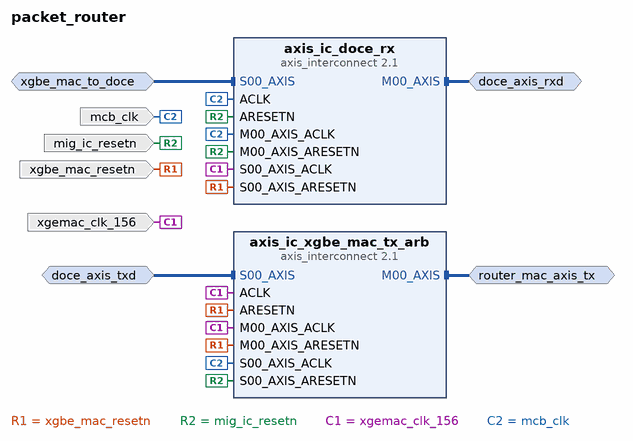
[diagram p0: block diagram of the top level]
# Vivado block design packet_router, xc7z045ffg900-2, Vivado 2017.4
create_bd_design packet_router

create_bd_intf_port -mode Master -vlnv xilinx.com:interface:axis_rtl:1.0 doce_axis_rxd
set_property -dict {CONFIG.FREQ_HZ 200000000 CONFIG.CLK_DOMAIN mcb_clk} [get_bd_intf_ports doce_axis_rxd]
create_bd_intf_port -mode Slave -vlnv xilinx.com:interface:axis_rtl:1.0 xgbe_mac_to_doce
set_property -dict [list \
  CONFIG.TDATA_NUM_BYTES 8 \
  CONFIG.TDEST_WIDTH 3 \
  CONFIG.TID_WIDTH 0 \
  CONFIG.TUSER_WIDTH 0 \
  CONFIG.HAS_TREADY 1 \
  CONFIG.HAS_TSTRB 0 \
  CONFIG.HAS_TKEEP 1 \
  CONFIG.HAS_TLAST 1 \
  CONFIG.FREQ_HZ 156250000 \
  CONFIG.CLK_DOMAIN xgemac_clk_156 \
  CONFIG.LAYERED_METADATA undef \
] [get_bd_intf_ports xgbe_mac_to_doce]
create_bd_intf_port -mode Master -vlnv xilinx.com:interface:axis_rtl:1.0 router_mac_axis_tx
set_property -dict {CONFIG.FREQ_HZ 156250000 CONFIG.CLK_DOMAIN xgemac_clk_156} [get_bd_intf_ports router_mac_axis_tx]
create_bd_intf_port -mode Slave -vlnv xilinx.com:interface:axis_rtl:1.0 doce_axis_txd
set_property -dict [list \
  CONFIG.TDATA_NUM_BYTES 8 \
  CONFIG.TDEST_WIDTH 3 \
  CONFIG.TID_WIDTH 0 \
  CONFIG.TUSER_WIDTH 0 \
  CONFIG.HAS_TREADY 1 \
  CONFIG.HAS_TSTRB 0 \
  CONFIG.HAS_TKEEP 1 \
  CONFIG.HAS_TLAST 1 \
  CONFIG.FREQ_HZ 200000000 \
  CONFIG.CLK_DOMAIN mcb_clk \
  CONFIG.LAYERED_METADATA undef \
] [get_bd_intf_ports doce_axis_txd]
create_bd_port -dir I -type rst xgbe_mac_resetn
create_bd_port -dir I -type rst mig_ic_resetn
create_bd_port -dir I -type clk xgemac_clk_156
set_property -dict [list \
  CONFIG.FREQ_HZ 156250000 \
  CONFIG.PHASE 0.000 \
  CONFIG.CLK_DOMAIN xgemac_clk_156 \
  CONFIG.ASSOCIATED_BUSIF router_mac_axis_tx:xgbe_mac_to_doce \
  CONFIG.ASSOCIATED_RESET xgbe_mac_resetn \
] [get_bd_ports xgemac_clk_156]
create_bd_port -dir I -type clk mcb_clk
set_property -dict [list \
  CONFIG.FREQ_HZ 200000000 \
  CONFIG.PHASE 0.000 \
  CONFIG.CLK_DOMAIN mcb_clk \
  CONFIG.ASSOCIATED_BUSIF doce_axis_rxd:doce_axis_txd \
  CONFIG.ASSOCIATED_RESET mig_ic_resetn:xgbe_mac_resetn \
] [get_bd_ports mcb_clk]

create_bd_cell -type ip -vlnv xilinx.com:ip:axis_interconnect:2.1 axis_ic_doce_rx
set_property -dict [list \
  CONFIG.NUM_SI 1 \
  CONFIG.NUM_MI 1 \
  CONFIG.S00_FIFO_DEPTH 512 \
  CONFIG.S00_FIFO_MODE 1 \
] [get_bd_cells axis_ic_doce_rx]
create_bd_cell -type ip -vlnv xilinx.com:ip:axis_interconnect:2.1 axis_ic_xgbe_mac_tx_arb
set_property -dict [list \
  CONFIG.NUM_SI 1 \
  CONFIG.NUM_MI 1 \
  CONFIG.S00_FIFO_DEPTH 512 \
  CONFIG.S01_FIFO_DEPTH 512 \
  CONFIG.S00_FIFO_MODE 1 \
  CONFIG.S01_FIFO_MODE 1 \
  CONFIG.M00_AXIS_BASETDEST 0x00000004 \
  CONFIG.M00_AXIS_HIGHTDEST 0x00000006 \
] [get_bd_cells axis_ic_xgbe_mac_tx_arb]

# ---- connections ----

connect_bd_intf_net [get_bd_intf_ports doce_axis_rxd] [get_bd_intf_pins axis_ic_doce_rx/M00_AXIS]
connect_bd_intf_net [get_bd_intf_ports xgbe_mac_to_doce] [get_bd_intf_pins axis_ic_doce_rx/S00_AXIS]
connect_bd_intf_net [get_bd_intf_ports router_mac_axis_tx] [get_bd_intf_pins axis_ic_xgbe_mac_tx_arb/M00_AXIS]
connect_bd_intf_net -intf_net S00_AXIS_0_1 [get_bd_intf_ports doce_axis_txd] [get_bd_intf_pins axis_ic_xgbe_mac_tx_arb/S00_AXIS]
connect_bd_net [get_bd_ports xgbe_mac_resetn] \
  [get_bd_pins axis_ic_doce_rx/S00_AXIS_ARESETN] [get_bd_pins axis_ic_xgbe_mac_tx_arb/ARESETN] \
  [get_bd_pins axis_ic_xgbe_mac_tx_arb/M00_AXIS_ARESETN]
connect_bd_net [get_bd_ports mig_ic_resetn] \
  [get_bd_pins axis_ic_doce_rx/ARESETN] [get_bd_pins axis_ic_doce_rx/M00_AXIS_ARESETN] \
  [get_bd_pins axis_ic_xgbe_mac_tx_arb/S00_AXIS_ARESETN]
connect_bd_net -net xgemac_clk_156_1 [get_bd_ports xgemac_clk_156] \
  [get_bd_pins axis_ic_doce_rx/S00_AXIS_ACLK] [get_bd_pins axis_ic_xgbe_mac_tx_arb/ACLK] \
  [get_bd_pins axis_ic_xgbe_mac_tx_arb/M00_AXIS_ACLK]
connect_bd_net [get_bd_ports mcb_clk] \
  [get_bd_pins axis_ic_xgbe_mac_tx_arb/S00_AXIS_ACLK] [get_bd_pins axis_ic_doce_rx/ACLK] \
  [get_bd_pins axis_ic_doce_rx/M00_AXIS_ACLK]

validate_bd_design
save_bd_design
